# Altium project IOT_GRN_MAIN V1.0 A.PrjPcb
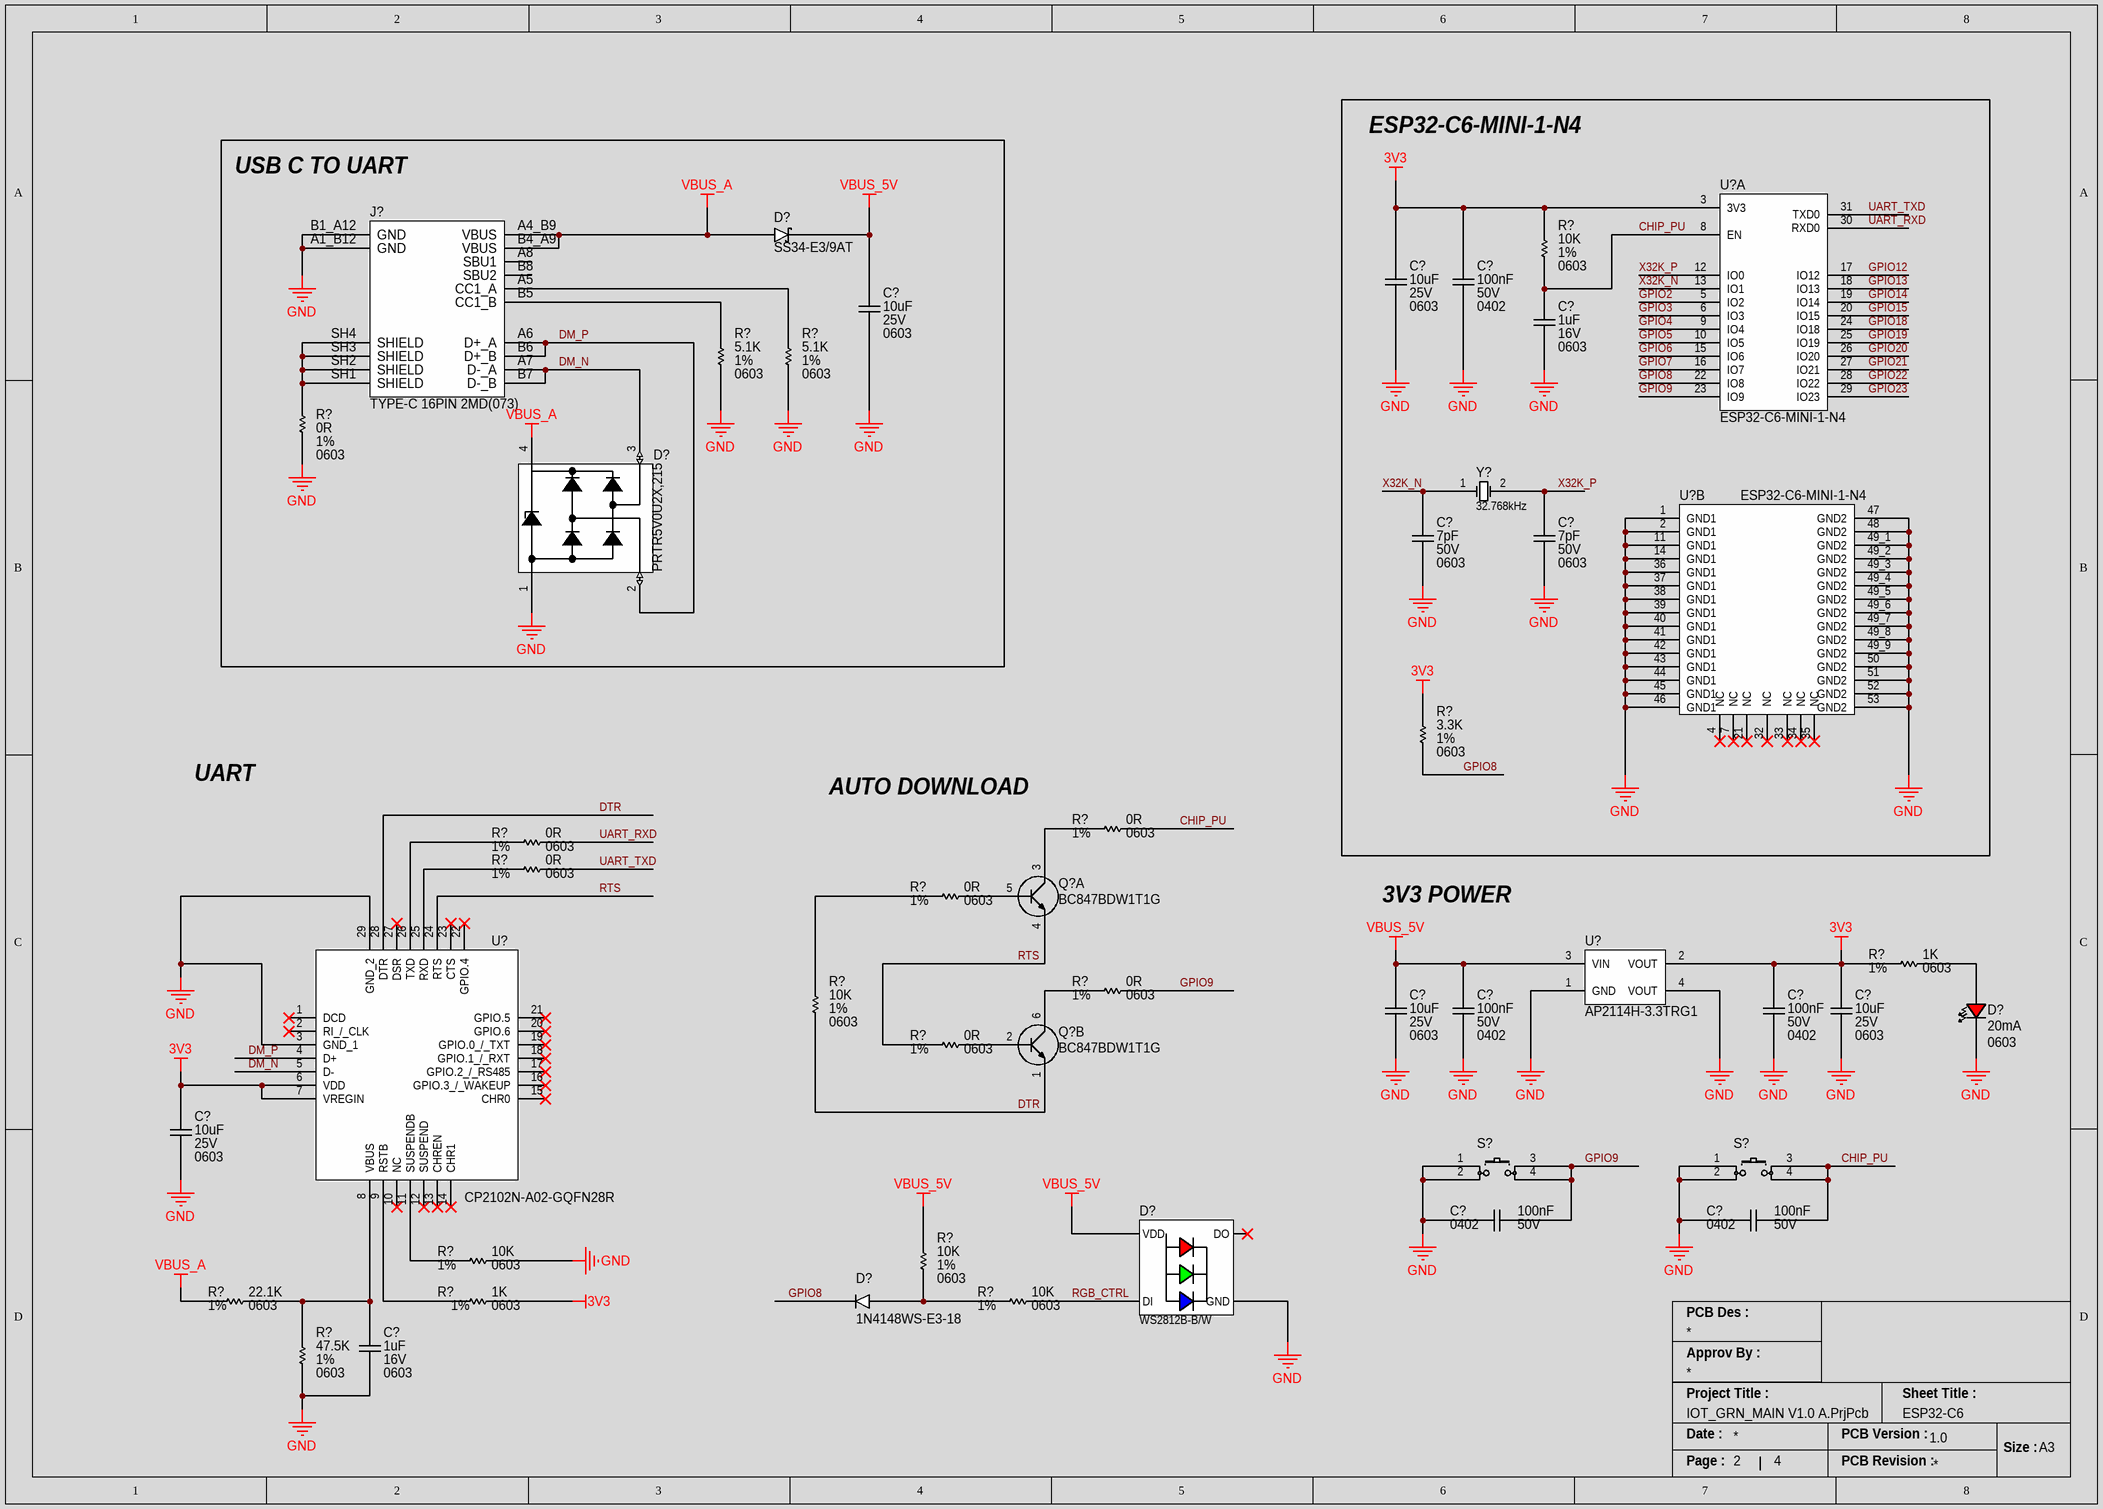
[diagram p0: IOT_GRN_MAIN V1.0 A - ESP32.SchDoc]
Letter: A; ProjectTitle: IOT_GRN_MAIN V1.0 A; Version: 1.0
2 sheets, 48 parts. Net scope: global (net labels, ports and power ports of the same name join across sheets).
Board file: IOT_GRN_MAIN V1.0 A.PcbDoc
Sheets:
  IOT_GRN_MAIN V1.0 A - ESP32.SchDoc
  IOT_GRN_MAIN V1.0 A - CONNECTORS.SchDoc

## Sheet IOT_GRN_MAIN V1.0 A - ESP32.SchDoc
size A3; SheetNumber: 2; SheetTotal: 4; Sheet Title: ESP32-C6

### Parts
(Parts that share a designator on the sheet are numbered #1, #2 ... from top to bottom, then left to right.)
C?#1  Case/Package: 0603  Capacitance: 10uF  Voltage Rating: 25V  [CAP_0603_CAPC1608X08N]  (hidden comment: GRM188R61E106MA73D)
C?#2  Voltage Rating: 50V  Capacitance: 100nF  Case/Package: 0402  [CAP_0402_CAPC1005X05N]  (hidden comment: GRM155R71H104KE14D)
C?#3  Case/Package: 0603  Capacitance: 10uF  Voltage Rating: 25V  [CAP_0603_CAPC1608X08N]  (hidden comment: GRM188R61E106MA73D)
C?#4  Voltage Rating: 16V  Capacitance: 1uF  Case/Package: 0603  [CAP_0603_CAPC1608X08N]  (hidden comment: CL10A105KO8NNNC)
C?#5  Voltage Rating (DC): 50V  Capacitance: 7pF  Case/Package: 0603  [CAP_0603_CAPC1608X08N]  (hidden comment: C1608C0G1H070D080AA)
C?#6  Voltage Rating (DC): 50V  Capacitance: 7pF  Case/Package: 0603  [CAP_0603_CAPC1608X08N]  (hidden comment: C1608C0G1H070D080AA)
C?#7  Case/Package: 0603  Capacitance: 10uF  Voltage Rating: 25V  [CAP_0603_CAPC1608X08N]  (hidden comment: GRM188R61E106MA73D)
C?#8  Voltage Rating: 50V  Capacitance: 100nF  Case/Package: 0402  [CAP_0402_CAPC1005X05N]  (hidden comment: GRM155R71H104KE14D)
C?#9  Voltage Rating: 50V  Capacitance: 100nF  Case/Package: 0402  [CAP_0402_CAPC1005X05N]  (hidden comment: GRM155R71H104KE14D)
C?#10  Case/Package: 0603  Capacitance: 10uF  Voltage Rating: 25V  [CAP_0603_CAPC1608X08N]  (hidden comment: GRM188R61E106MA73D)
C?#11  Case/Package: 0603  Capacitance: 10uF  Voltage Rating: 25V  [CAP_0603_CAPC1608X08N]  (hidden comment: GRM188R61E106MA73D)
C?#12  Voltage Rating: 50V  Capacitance: 100nF  Case/Package: 0402  [CAP_0402_CAPC1005X05N]  (hidden comment: GRM155R71H104KE14D)
C?#13  Voltage Rating: 50V  Capacitance: 100nF  Case/Package: 0402  [CAP_0402_CAPC1005X05N]  (hidden comment: GRM155R71H104KE14D)
C?#14  Voltage Rating: 16V  Capacitance: 1uF  Case/Package: 0603  [CAP_0603_CAPC1608X08N]  (hidden comment: CL10A105KO8NNNC)
D?#1  SS34-E3/9AT  [DIO_Vishay_SMC_MFG]
D?#2  PRTR5V0U2X,215  [DIO_TVS_Nexperia_SOT143B_MFG]
D?#3  Test Current: 20mA  Case/Package: 0603  [LED_0603-RED-0.75mm]  (hidden comment: LTST-C190KRKT)
D?#4  1N4148WS-E3-18  [DIO_SOD2713X115N]
D?#5  WS2812B-B/W  [LED_RGB_WS2812B_SNAPEDA]
J?  TYPE-C 16PIN 2MD(073)  [CONN_USB_C_16P]
Q?#1  BC847BDW1T1G  [TRANS_BJT_SOT65P210X110-6N]  (part A of 2)
Q?#2  BC847BDW1T1G  [TRANS_BJT_SOT65P210X110-6N]  (part B of 2)
R?#1  Resistance: 10K  Tolerance: 1%  Case/Package: 0603  [RES_0603_RESC1608X04N]  (hidden comment: AC0603FR-1010KL)
R?#2  Tolerance: 1%  Resistance: 5.1K  Case/Package: 0603  [RES_0603_RESC1608X04N]  (hidden comment: RC0603FR-075K1L)
R?#3  Tolerance: 1%  Resistance: 5.1K  Case/Package: 0603  [RES_0603_RESC1608X04N]  (hidden comment: RC0603FR-075K1L)
R?#4  Tolerance: 1%  Resistance: 0R  Case Code (Imperial): 0603  [RES_0603_RESC1608X04N]  (hidden comment: RC0603FR-070RL)
R?#5  Tolerance: 1%  Resistance: 3.3K  Case/Package: 0603  [RES_0603_RESC1608X04N]  (hidden comment: RC0603FR-073K3L)
R?#6  Tolerance: 1%  Resistance: 0R  Case Code (Imperial): 0603  [RES_0603_RESC1608X04N]  (hidden comment: RC0603FR-070RL)
R?#7  Tolerance: 1%  Resistance: 0R  Case Code (Imperial): 0603  [RES_0603_RESC1608X04N]  (hidden comment: RC0603FR-070RL)
R?#8  Tolerance: 1%  Resistance: 0R  Case Code (Imperial): 0603  [RES_0603_RESC1608X04N]  (hidden comment: RC0603FR-070RL)
R?#9  Tolerance: 1%  Resistance: 0R  Case Code (Imperial): 0603  [RES_0603_RESC1608X04N]  (hidden comment: RC0603FR-070RL)
R?#10  Resistance: 1K  Tolerance: 1%  Case/Package: 0603  [RES_0603_RESC1608X04N]  (hidden comment: AC0603FR-101KL)
R?#11  Tolerance: 1%  Resistance: 0R  Case Code (Imperial): 0603  [RES_0603_RESC1608X04N]  (hidden comment: RC0603FR-070RL)
R?#12  Resistance: 10K  Tolerance: 1%  Case/Package: 0603  [RES_0603_RESC1608X04N]  (hidden comment: AC0603FR-1010KL)
R?#13  Tolerance: 1%  Resistance: 0R  Case Code (Imperial): 0603  [RES_0603_RESC1608X04N]  (hidden comment: RC0603FR-070RL)
R?#14  Resistance: 10K  Tolerance: 1%  Case/Package: 0603  [RES_0603_RESC1608X04N]  (hidden comment: AC0603FR-1010KL)
R?#15  Resistance: 10K  Tolerance: 1%  Case/Package: 0603  [RES_0603_RESC1608X04N]  (hidden comment: AC0603FR-1010KL)
R?#16  Resistance: 22.1K  Tolerance: 1%  Case/Package: 0603  [RES_0603_RESC1608X04N]  (hidden comment: RC0603FR-0722K1L)
R?#17  Resistance: 1K  Tolerance: 1%  Case/Package: 0603  [RES_0603_RESC1608X04N]  (hidden comment: AC0603FR-101KL)
R?#18  Resistance: 10K  Tolerance: 1%  Case/Package: 0603  [RES_0603_RESC1608X04N]  (hidden comment: AC0603FR-1010KL)
R?#19  Tolerance: 1%  Resistance: 47.5K  Case/Package: 0603  [RES_0603_RESC1608X04N]  (hidden comment: AC0603FR-0747K5L)
S?#1  PTS526SK15SMTR2LFS  [SWT_NO_PTS526SK15SMTR2LFS]  (value not drawn)
S?#2  PTS526SK15SMTR2LFS  [SWT_NO_PTS526SK15SMTR2LFS]  (value not drawn)
U?#1  ESP32-C6-MINI-1-N4  [IC_ESP32-C6-MINI-1-N4]  (part A of 2)
U?#2  ESP32-C6-MINI-1-N4  [IC_ESP32-C6-MINI-1-N4]  (part B of 2)
U?#3  AP2114H-3.3TRG1  [IC_REG_SOT230P700X180-4N]
U?#4  CP2102N-A02-GQFN28R  [IC_BRIDGE_UART_QFN50P500X500X80-29N-D]
Y?  Frequency: 32.768kHz  [CRYSTAL_FC135327680KAAG5]  (hidden comment: FC-135 32.7680KA-AG5)

### Blocks framed on the sheet
ESP32-C6-MINI-1-N4: C?#1 C?#2 C?#4-C?#6 R?#1 R?#5 U?#1 U?#2 Y?
USB C TO UART: C?#3 D?#1 D?#2 J? R?#2-R?#4

### Nets
3V3: C?#1.2 C?#2.2 C?#9.2 C?#10.2 C?#11.2 R?#1.2 R?#5.2 R?#10.1 R?#17.2 U?#1.3(3V3) U?#3.2(VOUT) U?#4.6(VDD) U?#4.7(VREGIN)
GND: C?#1.1 C?#2.1 C?#3.1 C?#4.1 C?#5.2 C?#6.1 C?#7.1 C?#8.1 C?#9.1 C?#10.1 C?#11.1 C?#12.2 C?#13.2 C?#14.1 D?#2.1(GND) D?#3.1(C) D?#5.3(GND) J?.A1_B12(GND) J?.B1_A12(GND) R?#2.1 R?#3.1 R?#4.1 R?#15.2 R?#19.1 S?#1.1(COM_1) S?#1.2(COM2) S?#2.1(COM_1) S?#2.2(COM2) U?#2.1(GND1) U?#2.2(GND1) U?#2.11(GND1) U?#2.14(GND1) U?#2.36(GND1) U?#2.37(GND1) U?#2.38(GND1) U?#2.39(GND1) U?#2.40(GND1) U?#2.41(GND1) U?#2.42(GND1) U?#2.43(GND1) U?#2.44(GND1) U?#2.45(GND1) U?#2.46(GND1) U?#2.47(GND2) U?#2.48(GND2) U?#2.49_1(GND2) U?#2.49_2(GND2) U?#2.49_3(GND2) U?#2.49_4(GND2) U?#2.49_5(GND2) U?#2.49_6(GND2) U?#2.49_7(GND2) U?#2.49_8(GND2) U?#2.49_9(GND2) U?#2.50(GND2) U?#2.51(GND2) U?#2.52(GND2) U?#2.53(GND2) U?#3.1(GND) U?#3.4(VOUT) U?#4.3(GND_1) U?#4.29(GND_2)
VBUS_5V: C?#3.2 C?#7.2 C?#8.2 D?#1.1(K) D?#5.1(VDD) R?#14.1 U?#3.3(VIN)
VBUS_A: D?#1.2(A) D?#2.4(VCC) J?.A4_B9(VBUS) J?.B4_A9(VBUS) R?#16.1
CHIP_PU: C?#4.2 C?#13.1 R?#1.1 R?#6.1 S?#2.3(NO1) S?#2.4(NO2) U?#1.8(EN)
DM_N: D?#2.3(I/O_2) J?.A7(D-_A) J?.B7(D-_B) U?#4.5(D-)
DM_P: D?#2.2(I/O_1) J?.A6(D+_A) J?.B6(D+_B) U?#4.4(D+)
DTR: Q?#2.1(EMITTER_2) R?#12.1 U?#4.28(DTR)
GPIO2: U?#1.5(IO2)
GPIO3: U?#1.6(IO3)
GPIO4: U?#1.9(IO4)
GPIO5: U?#1.10(IO5)
GPIO6: U?#1.15(IO6)
GPIO7: U?#1.16(IO7)
GPIO8: D?#4.1(K) R?#5.1 U?#1.22(IO8)
GPIO9: C?#12.1 R?#11.1 S?#1.3(NO1) S?#1.4(NO2) U?#1.23(IO9)
GPIO12: U?#1.17(IO12)
GPIO13: U?#1.18(IO13)
GPIO14: U?#1.19(IO14)
GPIO15: U?#1.20(IO15)
GPIO18: U?#1.24(IO18)
GPIO19: U?#1.25(IO19)
GPIO20: U?#1.26(IO20)
GPIO21: U?#1.27(IO21)
GPIO22: U?#1.28(IO22)
GPIO23: U?#1.29(IO23)
RGB_CTRL: D?#5.4(DI) R?#18.1
RTS: Q?#1.4(EMITTER_1) R?#13.2 U?#4.24(RTS)
UART_RXD: R?#7.1 U?#1.30(RXD0)
UART_TXD: R?#8.1 U?#1.31(TXD0)
X32K_N: C?#6.2 U?#1.13(IO1) Y?.1(OSC1)
X32K_P: C?#5.1 U?#1.12(IO0) Y?.2(OSC2)
NetC?#14_2: C?#14.2 R?#16.2 R?#19.2 U?#4.8(VBUS)
NetD?#3_2: D?#3.2(A) R?#10.2
NetD?#4_2: D?#4.2(A) R?#14.2 R?#18.2
NetJ?_A5: J?.A5(CC1_A) R?#3.2
NetJ?_B5: J?.B5(CC1_B) R?#2.2
NetJ?_SH1: J?.SH1(SHIELD) J?.SH2(SHIELD) J?.SH3(SHIELD) J?.SH4(SHIELD) R?#4.2
NetQ?#1_3: Q?#1.3(COLLECTOR_1) R?#6.2
NetQ?#1_5: Q?#1.5(BASE_1) R?#9.1
NetQ?#2_2: Q?#2.2(BASE_2) R?#13.1
NetQ?#2_6: Q?#2.6(COLLECTOR_2) R?#11.2
NetR?#7_2: R?#7.2 U?#4.26(TXD)
NetR?#8_2: R?#8.2 U?#4.25(RXD)
NetR?#9_2: R?#9.2 R?#12.2
NetR?#15_1: R?#15.1 U?#4.11(SUSPENDB)
NetR?#17_1: R?#17.1 U?#4.9(RSTB)

Not connected (* = marked no-connect by the designer): D?#5 2(DO)*; J? A8(SBU1) B8(SBU2); U?#2 4(NC)* 7(NC)* 21(NC)* 32(NC)* 33(NC)* 34(NC)* 35(NC)*; U?#4 1(DCD)* 2(RI_/_CLK)* 10(NC)* 12(SUSPEND)* 13(CHREN)* 14(CHR1)* 15(CHR0)* 16(GPIO.3_/_WAKEUP)* 17(GPIO.2_/_RS485)* 18(GPIO.1_/_RXT)* 19(GPIO.0_/_TXT)* 20(GPIO.6)* 21(GPIO.5)* 22(GPIO.4)* 23(CTS)* 27(DSR)*

### Notes on the sheet
- UART
- AUTO DOWNLOAD
- 3V3 POWER
- PCB Des :
- Approv By :
- Project Title :
- Sheet Title :
- Date :
- PCB Version :
- Size :
- A3
- Page :
- PCB Revision :

### Library data of the parts
C?#1 C?#3 C?#7 C?#10 C?#11 = CAP_10UF_25V_X5R_0603: Multilayer Ceramic Capacitor, 10 uF, 25 V, ± 20%, X5R, 0603 [1608 Metric]; Manufacturer: Murata; Material: 4241ConductorMaterial; Supplier 1: Digi-Key; Manufacturer Part Number: GRM188R61E106MA73D; RoHS: Yes; Category: Ceramic Capacitors; Stock 1: 2712970; Pricing 1: 1=0.26, 10=0.168, 50=0.1176, 100=0.0949, 500=0.07054, 1000=0.06173 (USD); Mount: Surface Mount; Number of Pins: 2; Case Code (Imperial): 0603; Weight: 0.000222oz; Min Operating Temperature: -55°C; Max Operating Temperature: 85°C; Tolerance: 20%; Packaging: Cut Tape; Package Quantity: 1; Dielectric: X5R; Voltage: 25V; Termination: SMD/SMT; Voltage Rating (DC): 25V; Series: GRM; Construction: Flat; Length: 1.6mm; Width: 0.031inch; Height: 0.8mm; Thickness: 0.031inch; Depth: 0.8mm; Reach SVHC Compliant: No; Lead Free: Lead Free; RoHS Compliant: Yes; ComponentLink1URL: https://datasheet.ciiva.com/22776/c02e-22776427.pdf?src-supplier=Farnell; ComponentLink1Description: https://datasheet.ciiva.com/22776/c02e-22776427.pdf?src-supplier=Farnell; ComponentLink2URL: https://datasheet.ciiva.com/22619/c02e-22619674.pdf?src-supplier=Element14; ComponentLink2Description: https://datasheet.ciiva.com/22619/c02e-22619674.pdf?src-supplier=Element14; ComponentLink3URL: https://datasheet.ciiva.com/22776/608985-22776426.pdf?src-supplier=Farnell; ComponentLink3Description: https://datasheet.ciiva.com/22776/608985-22776426.pdf?src-supplier=Farnell; ComponentLink4URL: https://datasheet.ciiva.com/14906/partnumbering-e-01-14906431.pdf?src-supplier=Digi-Key; ComponentLink4Description: https://datasheet.ciiva.com/14906/partnumbering-e-01-14906431.pdf?src-supplier=Digi-Key; ComponentLink5URL: https://datasheet.ciiva.com/14906/partnumbering-e-01-14906429.pdf?src-supplier=Digi-Key; ComponentLink5Description: https://datasheet.ciiva.com/14906/partnumbering-e-01-14906429.pdf?src-supplier=Digi-Key; Supplier Part Number 1: 490-7202-1-ND; Case Code (Metric): 1608
C?#2 C?#8 C?#9 C?#12 C?#13 = CAP_100NF_50V_X7R_0402: Multilayer Ceramic Capacitor, 0.1 uF, 16 V, ± 10%, X7R, 0402 [1005 Metric]; Manufacturer: Murata; Dissipation Factor: 0.025%; Temperature Coefficient: 30ppm/°C; Supplier 1: DigiKey; Manufacturer Part Number: GRM155R71H104KE14D; RoHS: Yes; Category: Ceramic Capacitors; Stock 1: 13730790; Pricing 1: 1=0.1, 10=0.023, 50=0.0132, 100=0.0102, 500=0.00768, 1000=0.00603, 2500=0.00548, 5000=0.00504 (USD); Mount: Surface Mount; Number of Pins: 2NUMBER; Case Code (Metric): 1005; Material: Ceramic; Case Code (Imperial): 0402; Weight: 0.000212oz; Dielectric Material: Ceramic; Min Operating Temperature: -55°C; Max Operating Temperature: 125°C; Packaging: Tape and Reel; Package Quantity: 10000; Series: GRM; Tolerance: 10%; Dielectric: X7R; Termination: SMD/SMT; Voltage: 50V; Voltage Rating (DC): 50V; Construction: Flat; Length: 1mm; Width: 0.5mm; Height: 0.5mm; Depth: 0.5mm; Thickness: 0.022inch; Reach SVHC Compliant: No; RoHS Compliant: Yes; Lead Free: 5697LeadFree; ComponentLink1URL: http://www.farnell.com/datasheets/2079156.pdf?src-supplier=Farnell; ComponentLink1Description: http://www.farnell.com/datasheets/2079156.pdf?src-supplier=Farnell; ComponentLink2URL: http://www.mouser.com/ds/2/281/c02e-2905.pdf?src-supplier=Mouser; ComponentLink2Description: http://www.mouser.com/ds/2/281/c02e-2905.pdf?src-supplier=Mouser; ComponentLink3URL: http://www.farnell.com/datasheets/2079156.pdf?src-supplier=Newark; ComponentLink3Description: http://www.farnell.com/datasheets/2079156.pdf?src-supplier=Newark; ComponentLink4URL: https://datasheet.octopart.com/GRM155R71H104KE14D-Murata-datasheet-22122223.pdf?src-supplier=Future+Electronics; ComponentLink4Description: https://datasheet.octopart.com/GRM155R71H104KE14D-Murata-datasheet-22122223.pdf?src-supplier=Future+Electronics; ComponentLink5URL: https://search.murata.co.jp/Ceramy/image/img/A01X/G101/ENG/GRM155R71H104KE14-01.pdf?src-supplier=Digi-Key; ComponentLink5Description: https://search.murata.co.jp/Ceramy/image/img/A01X/G101/ENG/GRM155R71H104KE14-01.pdf?src-supplier=Digi-Key; ComponentLink6URL: http://psearch.en.murata.com/capacitor/product/GRM155R71H104KE14%23.pdf?src-supplier=Avnet; ComponentLink6Description: http://psearch.en.murata.com/capacitor/product/GRM155R71H104KE14%23.pdf?src-supplier=Avnet; ComponentLink7URL: https://datasheet.octopart.com/GRM155R71H104KE14D-Murata-datasheet-66077078.pdf?src-supplier=Element14; ComponentLink7Description: https://datasheet.octopart.com/GRM155R71H104KE14D-Murata-datasheet-66077078.pdf?src-supplier=Element14; Supplier Part Number 1: 490-10700-6-ND; Supplier 2: Digikey; Stock 2: 3706055; Pricing 2: 1=0.1, 10=0.037, 50=0.021, 100=0.0162, 500=0.01224, 1000=0.00961, 2500=0.00874, 5000=0.00804 (USD); Halogen Free: 5694HalogenFree; ComponentLink8URL: http://www.mouser.com/ds/2/447/UPY-GPHC_X5R_4V-to-50V_25-1131599.pdf?src-supplier=Mouser; ComponentLink8Description: http://www.mouser.com/ds/2/447/UPY-GPHC_X5R_4V-to-50V_25-1131599.pdf?src-supplier=Mouser; ComponentLink9URL: https://datasheet.octopart.com/CC0402KRX5R8BB104-Yageo-datasheet-137700082.pdf?src-supplier=Future+Electronics; ComponentLink9Description: https://datasheet.octopart.com/CC0402KRX5R8BB104-Yageo-datasheet-137700082.pdf?src-supplier=Future+Electronics; ComponentLink10URL: http://www.yageo.com/documents/recent/UPY-GPHC_X5R_4V-to-50V_25.pdf?src-supplier=Digikey; ComponentLink10Description: http://www.yageo.com/documents/recent/UPY-GPHC_X5R_4V-to-50V_25.pdf?src-supplier=Digikey; ComponentLink11URL: https://datasheet.octopart.com/CC0402KRX5R8BB104-Yageo-datasheet-140260304.pdf?src-supplier=Newark; ComponentLink11Description: https://datasheet.octopart.com/CC0402KRX5R8BB104-Yageo-datasheet-140260304.pdf?src-supplier=Newark; ComponentLink12URL: https://datasheet.octopart.com/CC0402KRX5R8BB104-Yageo-datasheet-170350636.pdf?src-supplier=Future+Electronics; ComponentLink12Description: https://datasheet.octopart.com/CC0402KRX5R8BB104-Yageo-datasheet-170350636.pdf?src-supplier=Future+Electronics; ComponentLink13URL: http://www.yageo.com/documents/recent/UPY-GPHC_X5R_4V-to-50V-16.pdf?src-supplier=Future+Electronics; ComponentLink13Description: http://www.yageo.com/documents/recent/UPY-GPHC_X5R_4V-to-50V-16.pdf?src-supplier=Future+Electronics; Supplier Part Number 2: 311-1697-1-ND
C?#4 C?#14 = CAP_1UF_16V_X5R_0603: CAP CER 1UF 16V X5R 0603; Manufacturer: Samsung; Material: Ceramic; Tolerance: 10%; Manufacturer Part Number: CL10A105KO8NNNC; RoHS: Yes; Category: Ceramic Capacitors; Stock 1: 252255; Pricing 1: 1=0.10000, 10=0.03300, 50=0.01800, 100=0.01470, 500=0.01050, 1000=0.00825 (USD); Mount: Surface Mount; Case Code (Metric): 1608; Case Code (Imperial): 0603; Contact Plating: Tin; Min Operating Temperature: -55°C; Max Operating Temperature: 85°C; Package Quantity: 1; Packaging: Tape and Reel; Dielectric: X5R; Voltage Rating (DC): 16V; Series: CL; Voltage: 16V; Construction: Flat; Length: 1.6mm; Width: 0.031inch; Height: 0.8mm; Thickness: 0.035inch; Depth: 0.8mm; Radiation Hardening: No; Lead Free: Lead Free; RoHS Compliant: Yes; ComponentLink1URL: https://datasheet.ciiva.com/16199/cl10a105ko8nnnc-16199033.pdf?src-supplier=Future+Electronics; ComponentLink1Description: https://datasheet.ciiva.com/16199/cl10a105ko8nnnc-16199033.pdf?src-supplier=Future+Electronics; ComponentLink2URL: https://datasheet.ciiva.com/15195/getdatasheetpartid-359688-15195706.pdf?src-supplier=Verical; ComponentLink2Description: https://datasheet.ciiva.com/15195/getdatasheetpartid-359688-15195706.pdf?src-supplier=Verical; ComponentLink3URL: https://datasheet.ciiva.com/29198/458190-da-01-en-vs-kondensator-0603-29198480.pdf?src-supplier=Conrad; ComponentLink3Description: https://datasheet.ciiva.com/29198/458190-da-01-en-vs-kondensator-0603-29198480.pdf?src-supplier=Conrad; Supplier 1: Digi-Key; Supplier 2: Mouser; Supplier 3: Newark; Supplier Part Number 1: 1276-1034-1-ND; Supplier Part Number 2: 187-CL10A105KO8NNNC; Supplier Part Number 3: 82AC9279
C?#5 C?#6 = CAP_7PF_50V_NP0_0603: C Series 0603 7 pF 50 V ±0.5 pF Tolerance C0G SMT Multilayer Ceramic Capacitor; Manufacturer: TDK; Supplier 1: Digi-Key; Manufacturer Part Number: C1608C0G1H070D080AA; RoHS: Yes; Category: Ceramic Capacitors; Stock 1: 64389; Pricing 1: 1=0.1, 10=0.073, 50=0.0414, 100=0.0343, 500=0.02402, 1000=0.01989 (USD); Mount: Surface Mount; Dielectric Material: Ceramic; Case Code (Metric): 1608; Case Code (Imperial): 0603; Weight: 7.1E-05oz; Min Operating Temperature: -55°C; Max Operating Temperature: 125°C; Construction: Flat; Packaging: Tape and Reel; Voltage Rating: 50V; Package Quantity: 4000; Dielectric: C0G; Termination: SMD/SMT; Series: C; Length: 1.6mm; Width: 0.8mm; Height: 0.8mm; Depth: 0.8mm; Lead Free: Lead Free; RoHS Compliant: Yes; Reach SVHC Compliant: No; ComponentLink1URL: https://datasheet.ciiva.com/24217/c1608c0g1h070d080aa-264569-24217366.pdf?src-supplier=Mouser; ComponentLink1Description: https://datasheet.ciiva.com/24217/c1608c0g1h070d080aa-264569-24217366.pdf?src-supplier=Mouser; ComponentLink2URL: https://datasheet.ciiva.com/16427/e413-c-16427733.pdf?src-supplier=Future+Electronics; ComponentLink2Description: https://datasheet.ciiva.com/16427/e413-c-16427733.pdf?src-supplier=Future+Electronics; ComponentLink3URL: https://datasheet.ciiva.com/6293/tdkmlcccaprange-6293212.pdf?src-supplier=Digi-Key; ComponentLink3Description: https://datasheet.ciiva.com/6293/tdkmlcccaprange-6293212.pdf?src-supplier=Digi-Key; ComponentLink4URL: https://datasheet.ciiva.com/6293/tdkmlcccaprange-6293215.pdf?src-supplier=Digi-Key; ComponentLink4Description: https://datasheet.ciiva.com/6293/tdkmlcccaprange-6293215.pdf?src-supplier=Digi-Key; Supplier Part Number 1: 445-5041-1-ND
D?#1 = DIO_SCTKY_40V_3A: Rectifier Diode, schottky, 40V V(Rrm), do-214Ab / Smc; Manufacturer: Vishay Semiconductors; Max Surge Current: 100A; Element Configuration: Single; Max Reverse Leakage Current: 500uA; Average Rectified Current: 3A; Forward Voltage: 500mV; Supplier 1: TTI; Manufacturer Part Number: SS34-E3/9AT; RoHS: Yes; Category: Rectifier Diodes; Stock 1: 7000; Pricing 1: 3500=0.18200 (USD); Mount: Surface Mount; Case/Package: SMC; Number of Pins: 2; Min Operating Temperature: -55°C; Max Operating Temperature: 125°C; Package Quantity: 3500; Packaging: Tape and Reel; Peak Non-Repetitive Surge Current: 100A; Max Reverse Voltage (DC): 40V; Series: -; Radiation Hardening: No; RoHS Compliant: Yes; ComponentLink1URL: https://datasheet.ciiva.com/920/ss32-920172.pdf?src-supplier=Digi-Key; ComponentLink1Description: https://datasheet.ciiva.com/920/ss32-920172.pdf?src-supplier=Digi-Key; Supplier Part Number 1: SS34-E3/9AT; Max Reverse Current: 500uA; Max Repetitive Reverse Voltage (Vrrm): 40V; Forward Current: 3A
D?#2 = DIO_TVS_USB_PRTR5V0U2X,215: PRTR5V0U2X - Ultra low capacitance double rail-to-rail ESD protection diode; Manufacturer: Nexperia; Supplier 1: Mouser; Manufacturer Part Number: PRTR5V0U2X,215; RoHS: Yes; Category: ESD and Circuit Protection ICs; Stock 1: 109301; Pricing 1: 1=0.45, 10=0.368, 50=0.367, 100=0.262, 500=0.21, 1000=0.171, 3000=0.135, 9000=0.129, 10000=0.129, 24000=0.127, 45000=0.125 (USD); RoHS Compliant: Yes; ComponentLink1URL: http://www.farnell.com/datasheets/109718.pdf?src-supplier=Farnell; ComponentLink1Description: http://www.farnell.com/datasheets/109718.pdf?src-supplier=Farnell; ComponentLink2URL: https://assets.nexperia.com/documents/data-sheet/PRTR5V0U2X.pdf?src-supplier=Digikey; ComponentLink2Description: https://assets.nexperia.com/documents/data-sheet/PRTR5V0U2X.pdf?src-supplier=Digikey; ComponentLink3URL: http://www.farnell.com/datasheets/109718.pdf?src-supplier=Newark; ComponentLink3Description: http://www.farnell.com/datasheets/109718.pdf?src-supplier=Newark; ComponentLink4URL: https://datasheet.octopart.com/PRTR5V0U2X%2C215-Nexperia-datasheet-5405949.pdf?src-supplier=Element14; ComponentLink4Description: https://datasheet.octopart.com/PRTR5V0U2X%2C215-Nexperia-datasheet-5405949.pdf?src-supplier=Element14; Supplier Part Number 1: 771-PRTR5V0U2X-T/R
D?#3 = LED_DIO_RED_20mA_0603: LED,  LTST-C190KRKT; Manufacturer: Vishay Lite-On; Color: Red; Lens Color: Colorless; Luminous Intensity: 54mcd; Viewing Angle: 130°; Lens Style: Diffused,Colorless,Clear,Rectangular; Power Rating: 75mW; Dominant Wavelength: 631nm; Lens Transparency: Clear; Number of Elements: 1; Wavelength: 639nm; Reverse Voltage: 5V; Forward Current: 30mA; Forward Voltage: 2.4V; Manufacturer Part Number: LTST-C190KRKT; RoHS: Yes; Category: LEDs; Stock 1: 712361; Pricing 1: 1=0.24000, 10=0.13200, 100=0.06110, 500=0.05640, 1000=0.04418, 2000=0.04324 (USD); Mount: Surface Mount; Number of Pins: 2; Case Code (Metric): 1608; Case Code (Imperial): 0603; Min Operating Temperature: -55°C; Max Operating Temperature: 85°C; Packaging: Tape and Reel; Package Quantity: 1; Illumination Color: Red; Power Dissipation: 75mW; Number of LEDs: 1; Length: 1.6mm; Width: 0.8mm; Height: 0.8mm; Depth: 0.8mm; Radiation Hardening: No; Lead Free: Lead Free; RoHS Compliant: Yes; ComponentLink1URL: https://datasheet.ciiva.com/19482/1260381-19482354.pdf?src-supplier=Jameco; ComponentLink1Description: https://datasheet.ciiva.com/19482/1260381-19482354.pdf?src-supplier=Jameco; ComponentLink2URL: https://datasheet.ciiva.com/12403/100-ltst-c190krkt-59805-12403895.pdf?src-supplier=Mouser; ComponentLink2Description: https://datasheet.ciiva.com/12403/100-ltst-c190krkt-59805-12403895.pdf?src-supplier=Mouser; ComponentLink3URL: https://datasheet.ciiva.com/16427/ltst-c190krkt-16427674.pdf?src-supplier=Future+Electronics; ComponentLink3Description: https://datasheet.ciiva.com/16427/ltst-c190krkt-16427674.pdf?src-supplier=Future+Electronics; ComponentLink4URL: https://datasheet.ciiva.com/15117/getdatasheetpartid-57395-15117240.pdf?src-supplier=Verical; ComponentLink4Description: https://datasheet.ciiva.com/15117/getdatasheetpartid-57395-15117240.pdf?src-supplier=Verical; ComponentLink5URL: https://datasheet.ciiva.com/11774/0900766b80dc02a9-11774043.pdf?src-supplier=Rs; ComponentLink5Description: https://datasheet.ciiva.com/11774/0900766b80dc02a9-11774043.pdf?src-supplier=Rs; ComponentLink6URL: https://datasheet.ciiva.com/2109/s-110-ltst-c190krkt-2109992.pdf?src-supplier=Digi-Key; ComponentLink6Description: https://datasheet.ciiva.com/2109/s-110-ltst-c190krkt-2109992.pdf?src-supplier=Digi-Key; ComponentLink7URL: https://datasheet.ciiva.com/2109/s-110-ltst-c190krkt-2109991.pdf?src-supplier=Digi-Key; ComponentLink7Description: https://datasheet.ciiva.com/2109/s-110-ltst-c190krkt-2109991.pdf?src-supplier=Digi-Key; ComponentLink8URL: https://datasheet.ciiva.com/2109/s-110-ltst-c190krkt-2109993.pdf?src-supplier=Digi-Key; ComponentLink8Description: https://datasheet.ciiva.com/2109/s-110-ltst-c190krkt-2109993.pdf?src-supplier=Digi-Key; ComponentLink9URL: https://datasheet.ciiva.com/26937/getdatasheetpartid-631582-26937958.pdf?src-supplier=Verical; ComponentLink9Description: https://datasheet.ciiva.com/26937/getdatasheetpartid-631582-26937958.pdf?src-supplier=Verical; Supplier 1: Digi-Key; Supplier 2: Mouser; Supplier 3: Arrow Electronics; Supplier Part Number 1: 160-1436-6-ND; Supplier Part Number 2: 859-LTST-C190KRKT; Supplier Part Number 3: LTST-C190KRKT
D?#4 = DIO_RECT_100V_150mA_1N4148WS-E3-18: Rectifier Diode Small Signal Switching Si 100V 0.15A 4ns 2-Pin SOD-323 T/R; Manufacturer: Vishay Semiconductors; Max Surge Current: 350mA; Forward Voltage: 1.2V; Forward Current: 150mA; Max Power Dissipation: 200mW; Max Reverse Leakage Current: 100uA; Max Reverse Voltage (DC): 75V; Supplier 1: Digi-Key; Manufacturer Part Number: 1N4148WS-E3-18; RoHS: Yes; Category: Rectifier Diodes; Stock 1: 23792; Pricing 1: 1=0.23, 10=0.155, 100=0.0755, 500=0.06302, 1000=0.04378, 2000=0.03795, 5000=0.0352 (USD); Mount: Surface Mount; Number of Pins: 2; Weight: 0.000152oz; Contact Plating: Tin; Min Operating Temperature: -55°C; Max Operating Temperature: 150°C; Packaging: Tape and Reel; Recovery Time: 4ns; Package Quantity: 10000; Average Rectified Current: 150mA; Reverse Recovery Time: 4ns; Peak Non-Repetitive Surge Current: 350mA; Max Repetitive Reverse Voltage (Vrrm): 100V; Max Forward Surge Current (Ifsm): 350mA; Series: -; Radiation Hardening: No; RoHS Compliant: Yes; Reach SVHC Compliant: Unknown; ComponentLink1URL: https://datasheet.ciiva.com/29885/1n4148ws-29885947.pdf?src-supplier=Avnet; ComponentLink1Description: https://datasheet.ciiva.com/29885/1n4148ws-29885947.pdf?src-supplier=Avnet; Supplier Part Number 1: 1N4148WS-E3-18GICT-ND
D?#5 = LED_DIO_RGB_WS2812B-B/W: RGB SMD5050 Light Emitting Diodes (LED) ROHS - LCSC; Manufacturer: Worldsemi; Manufacturer Part Number: 5050; Color: Blue,Green,Red; Number of LEDs: 10; Supplier 1: LCSC; RoHS: Yes; Category: LEDs; Stock 1: 1874; Mount: Surface Mount; Length: 5mm; Width: 5mm; Supplier Part Number 1: 1528-1104-ND; ComponentLink1Description: https://www.lcsc.com/product-detail/Light-Emitting-Diodes-LED_Worldsemi-WS2812B-B-W_C114586.html; ComponentLink1URL: https://www.lcsc.com/product-detail/Light-Emitting-Diodes-LED_Worldsemi-WS2812B-B-W_C114586.html; Pricing 1: 1=0.09(USD)
J? = CONN_USB_TYPEC_2.0_16P_TYPE-C 16PIN 2MD(073): 5A 1 Surface Mount 16P Female -25℃~+85℃ Type-C SMD USB Connectors ROHS; Manufacturer: SHOU HAN; Supplier 1: LCSC; Manufacturer Part Number: TYPE-C 16PIN 2MD(073); RoHS: No; Category: Connectors; Pricing 1: 0.0523 (USD); Supplier Part Number 1: 664-12402012E212ACT-ND
Q?#1 Q?#2 = TRANS_BIPOLAR_NPN_BC847BDW1T1G: ON Semi BC847BDW1T1G Dual NPN Bipolar Transistor; 0.1 A; 45 V; 6-Pin SC-88; Manufacturer: ON Semiconductor; Max Power Dissipation: 380mW; Max Collector Current: 100mA; Collector Base Voltage (VCBO): 50V; Transition Frequency: 100MHz; Collector Emitter Breakdown Voltage: 45V; Collector-emitter Voltage-Max: 600mV; hFE Min: 200; Emitter Base Voltage (VEBO): 6V; Number of Elements: 2; Supplier 1: Digikey; Manufacturer Part Number: BC847BDW1T1G; RoHS: Yes; Category: BJTs; Stock 1: 35041; Pricing 1: 1=0.22, 10=0.149, 100=0.0729, 500=0.06078, 1000=0.04224 (USD); Case/Package: SOT-363-6; Number of Pins: 6; Contact Plating: Tin,Matte; Min Operating Temperature: -55°C; Max Operating Temperature: 150°C; Package Quantity: 3000; Packaging: Tape and Reel; Max Breakdown Voltage: 45V; Polarity: NPN; Series: -; Collector Emitter Voltage (VCEO): 45V; Collector Emitter Saturation Voltage: 600mV; Power Dissipation: 380mW; Max Frequency: 100MHz; Gain Bandwidth Product: 100MHz; Frequency: 100MHz; Voltage Rating (DC): 45V; Current Rating: 100mA; Length: 2mm; Width: 1.25mm; Height: 0.9mm; Radiation Hardening: No; RoHS Compliant: Yes; Lead Free: Lead Free; Halogen Free: Halogen Free; Reach SVHC Compliant: No; ComponentLink1URL: https://datasheet.ciiva.com/15138/getdatasheetpartid-32925-15138586.pdf?src-supplier=Verical; ComponentLink1Description: https://datasheet.ciiva.com/15138/getdatasheetpartid-32925-15138586.pdf?src-supplier=Verical; ComponentLink2URL: https://datasheet.ciiva.com/34303/2012187-34303831.pdf?src-supplier=Jameco; ComponentLink2Description: https://datasheet.ciiva.com/34303/2012187-34303831.pdf?src-supplier=Jameco; ComponentLink3URL: https://datasheet.ciiva.com/968/bc846bdw1t1-d-968805.pdf?src-supplier=Digikey; ComponentLink3Description: https://datasheet.ciiva.com/968/bc846bdw1t1-d-968805.pdf?src-supplier=Digikey; ComponentLink4URL: https://datasheet.ciiva.com/968/bc846bdw1t1-d-968806.pdf?src-supplier=Digikey; ComponentLink4Description: https://datasheet.ciiva.com/968/bc846bdw1t1-d-968806.pdf?src-supplier=Digikey; ComponentLink5URL: https://datasheet.ciiva.com/968/bc846bdw1t1-d-968807.pdf?src-supplier=Digikey; ComponentLink5Description: https://datasheet.ciiva.com/968/bc846bdw1t1-d-968807.pdf?src-supplier=Digikey; ComponentLink6URL: https://datasheet.ciiva.com/1215/bc846bdw1t1-d-1215105.pdf?src-supplier=Farnell; ComponentLink6Description: https://datasheet.ciiva.com/1215/bc846bdw1t1-d-1215105.pdf?src-supplier=Farnell; ComponentLink7URL: https://datasheet.ciiva.com/22653/1708249-22653900.pdf?src-supplier=Element14; ComponentLink7Description: https://datasheet.ciiva.com/22653/1708249-22653900.pdf?src-supplier=Element14; ComponentLink8URL: https://datasheet.ciiva.com/16201/bc846bdw1t1-d-16201675.pdf?src-supplier=Future+Electronics; ComponentLink8Description: https://datasheet.ciiva.com/16201/bc846bdw1t1-d-16201675.pdf?src-supplier=Future+Electronics; Supplier Part Number 1: BC847BDW1T1GOSCT-ND
R?#1 R?#12 R?#14 R?#15 R?#18 = RES_10K_1%_100mW_0603: Chip Resistor Automotive Grade Thick Film 0603 10kOhm 1% Paper T/R; Manufacturer: Yageo; Voltage Rating: 50V; Power Rating: 100mW; Temperature Coefficient: 100ppm/°C; Manufacturer Part Number: AC0603FR-1010KL; RoHS: Yes; Category: Chip SMD Resistors; Stock 1: 172891; Pricing 1: 1=0.10000, 10=0.02500, 100=0.01030, 1000=0.00463, 2500=0.00402, 5000=0.00332 (USD); Case Code (Imperial): 0603; Case Code (Metric): 1608; Weight: 7.1E-05oz; Min Operating Temperature: -55°C; Max Operating Temperature: 155°C; Packaging: Tape and Reel; Termination: SMD/SMT; Series: AC; Length: 1.6mm; Width: 0.8mm; Height: 0.45mm; RoHS Compliant: Yes; ComponentLink1URL: http://www.mouser.com/ds/2/447/yageodocoutput-1111992.pdf?src-supplier=Mouser; ComponentLink1Description: http://www.mouser.com/ds/2/447/yageodocoutput-1111992.pdf?src-supplier=Mouser; Supplier 1: Digi-Key; Supplier 2: Newark; Supplier 3: Avnet; Supplier Part Number 1: 13-AC0603FR-1010KLCT-ND; Supplier Part Number 2: 49AK0662; Supplier Part Number 3: 49AK0662
R?#2 R?#3 = RES_5.1K_1%_100mW_0603: SMD Chip Resistor, 5.1 kOhm, ± 1%, 100 mW, 0603 [1608 Metric], Thick Film, General Purpose; Manufacturer: Yageo; Power Rating: 100mW; Temperature Coefficient: 100ppm/°C; Voltage Rating (DC): 50V; Supplier 1: Digi-Key; Manufacturer Part Number: RC0603FR-075K1L; RoHS: Yes; Category: Chip SMD Resistors; Stock 1: 3197702; Pricing 1: 1=0.1, 10=0.018, 50=0.0106, 100=0.0088, 500=0.00592, 1000=0.00505 (USD); Number of Pins: 2; Case Code (Imperial): 0603; Case Code (Metric): 1608; Size Code: 0603; Min Operating Temperature: -55°C; Max Operating Temperature: 155°C; Series: RC; Packaging: Tape and Reel; Package Quantity: 1; Termination: SMD/SMT; Resistor Type: Thick Film; Number of Terminations: 2; Max Power Dissipation: 100mW; Features: Moisture Resistant; Resistance Tolerance: 1%; Construction: Rectangular; Length: 0.063inch; Width: 0.031inch; Height: 0.022inch; Depth: 0.8mm; RoHS Compliant: Yes; Reach SVHC Compliant: No; Military Standard: Not; Lead Free: Lead Free; ComponentLink1URL: https://datasheet.ciiva.com/15189/getdatasheetpartid-326732-15189786.pdf?src-supplier=Verical; ComponentLink1Description: https://datasheet.ciiva.com/15189/getdatasheetpartid-326732-15189786.pdf?src-supplier=Verical; ComponentLink2URL: https://datasheet.ciiva.com/46395/443971-46395016.pdf?src-supplier=Element14; ComponentLink2Description: https://datasheet.ciiva.com/46395/443971-46395016.pdf?src-supplier=Element14; ComponentLink3URL: https://datasheet.ciiva.com/2454/pyu-r-int-thick-7-2454045.pdf?src-supplier=Digi-Key; ComponentLink3Description: https://datasheet.ciiva.com/2454/pyu-r-int-thick-7-2454045.pdf?src-supplier=Digi-Key; ComponentLink4URL: https://datasheet.ciiva.com/2454/pyu-r-int-thick-7-2454046.pdf?src-supplier=Digi-Key; ComponentLink4Description: https://datasheet.ciiva.com/2454/pyu-r-int-thick-7-2454046.pdf?src-supplier=Digi-Key; ComponentLink5URL: https://datasheet.ciiva.com/2454/pyu-r-int-thick-7-2454047.pdf?src-supplier=Digi-Key; ComponentLink5Description: https://datasheet.ciiva.com/2454/pyu-r-int-thick-7-2454047.pdf?src-supplier=Digi-Key; Supplier Part Number 1: 311-5.10KHRCT-ND; Voltage Rating: 50V
R?#4 R?#6-R?#9 R?#11 R?#13 = RES_0R_1%_100mW_0603: RC Series 0603 0.1 W 0 Ohm Jumper Surface Mount Thick Film Chip Resistor; Manufacturer: Yageo; Power Rating: 100mW; Voltage Rating (DC): 50V; Temperature Coefficient: 200ppm/°C; Current Rating: 1A; Working Voltage: 75V; Supplier 1: Digi-Key; Manufacturer Part Number: RC0603FR-070RL; RoHS: Yes; Category: Chip SMD Resistors; Stock 1: 2843917; Pricing 1: 1=0.10000, 10=0.01800, 25=0.01320, 50=0.01000, 100=0.00730, 250=0.00560, 500=0.00448, 1000=0.00329 (USD); Case/Package: 0603; Number of Pins: 2; Contact Plating: Tin,Matte; Case Code (Metric): 1608; Min Operating Temperature: -55°C; Max Operating Temperature: 155°C; Packaging: Tape and Reel; Resistor Type: Thick Film; Package Quantity: 5000; Voltage Rating: 50V; Number of Terminations: 2; Termination: SMD/SMT; Max Power Dissipation: 100mW; Features: Moisture Resistant; Series: RC; Construction: Rectangular; Resistance Tolerance: 1%; Technology: THICK FILM; Length: 1.6mm; Width: 0.8mm; Height: 0.45mm; Depth: 0.8mm; Radiation Hardening: No; Reach SVHC Compliant: Yes; Lead Free: Lead Free; RoHS Compliant: Yes; Military Standard: Not; ComponentLink1URL: https://datasheet.ciiva.com/11808/0900766b80f96399-11808172.pdf?src-supplier=Rs; ComponentLink1Description: https://datasheet.ciiva.com/11808/0900766b80f96399-11808172.pdf?src-supplier=Rs; ComponentLink2URL: https://datasheet.ciiva.com/5684/443971-5684699.pdf?src-supplier=Farnell; ComponentLink2Description: https://datasheet.ciiva.com/5684/443971-5684699.pdf?src-supplier=Farnell; ComponentLink3URL: https://datasheet.ciiva.com/7983/443971-7983627.pdf?src-supplier=Element14; ComponentLink3Description: https://datasheet.ciiva.com/7983/443971-7983627.pdf?src-supplier=Element14; ComponentLink4URL: https://datasheet.ciiva.com/22643/1868787-22643388.pdf?src-supplier=Element14; ComponentLink4Description: https://datasheet.ciiva.com/22643/1868787-22643388.pdf?src-supplier=Element14; ComponentLink5URL: https://datasheet.ciiva.com/46382/443971-46382072.pdf?src-supplier=Element14; ComponentLink5Description: https://datasheet.ciiva.com/46382/443971-46382072.pdf?src-supplier=Element14; ComponentLink6URL: https://datasheet.ciiva.com/29721/pyu-r-int-thick-7-29721178.pdf?src-supplier=Digi-Key; ComponentLink6Description: https://datasheet.ciiva.com/29721/pyu-r-int-thick-7-29721178.pdf?src-supplier=Digi-Key; ComponentLink7URL: https://datasheet.ciiva.com/29721/pyu-rc0603-51-rohs-l-4-29721179.pdf?src-supplier=Digi-Key; ComponentLink7Description: https://datasheet.ciiva.com/29721/pyu-rc0603-51-rohs-l-4-29721179.pdf?src-supplier=Digi-Key; ComponentLink8URL: https://datasheet.ciiva.com/5558/rc0603-272842-5558341.pdf?src-supplier=Mouser; ComponentLink8Description: https://datasheet.ciiva.com/5558/rc0603-272842-5558341.pdf?src-supplier=Mouser; Supplier Part Number 1: 311-0.0HRCT-ND
R?#5 = RES_3.3K_1%_100mW_0603: SMD Chip Resistor, 3.3 kOhm, ± 1%, 100 mW, 0603 [1608 Metric], Thick Film, General Purpose; Manufacturer: Yageo; Voltage Rating (DC): 50V; Temperature Coefficient: 100ppm/°C; Power Rating: 100mW; Supplier 1: Digikey; Manufacturer Part Number: RC0603FR-073K3L; RoHS: Yes; Category: Chip SMD Resistors; Stock 1: 374027; Pricing 1: 1=0.1, 10=0.019, 50=0.0112, 100=0.0093, 500=0.00622, 1000=0.00532 (USD); Number of Pins: 2; Case Code (Imperial): 0603; Case Code (Metric): 1608; Size Code: 0603; Min Operating Temperature: -55°C; Max Operating Temperature: 155°C; Packaging: Tape and Reel; Resistor Type: Thick Film; Voltage Rating: 50V; Package Quantity: 1; Termination: SMD/SMT; Number of Terminations: 2; Max Power Dissipation: 100mW; Features: Moisture Resistant; Series: RC; Resistance Tolerance: 1%; Construction: Rectangular; Voltage Rating (AC): 50V; Length: 1.6mm; Width: 0.8mm; Height: 0.022inch; Depth: 0.8mm; Reach SVHC Compliant: No; Lead Free: Lead Free; Military Standard: Not; RoHS Compliant: Yes; ComponentLink1URL: https://datasheet.ciiva.com/2453/pyu-r-int-thick-7-2453926.pdf?src-supplier=Digikey; ComponentLink1Description: https://datasheet.ciiva.com/2453/pyu-r-int-thick-7-2453926.pdf?src-supplier=Digikey; ComponentLink2URL: https://datasheet.ciiva.com/2453/pyu-r-int-thick-7-2453927.pdf?src-supplier=Digikey; ComponentLink2Description: https://datasheet.ciiva.com/2453/pyu-r-int-thick-7-2453927.pdf?src-supplier=Digikey; ComponentLink3URL: https://datasheet.ciiva.com/7746/443971-7746344.pdf?src-supplier=Element14; ComponentLink3Description: https://datasheet.ciiva.com/7746/443971-7746344.pdf?src-supplier=Element14; ComponentLink4URL: https://datasheet.ciiva.com/7746/1686128-7746345.pdf?src-supplier=Element14; ComponentLink4Description: https://datasheet.ciiva.com/7746/1686128-7746345.pdf?src-supplier=Element14; ComponentLink5URL: https://datasheet.ciiva.com/7746/443971-7746346.pdf?src-supplier=Element14; ComponentLink5Description: https://datasheet.ciiva.com/7746/443971-7746346.pdf?src-supplier=Element14; ComponentLink6URL: https://datasheet.ciiva.com/46440/1868787-46440905.pdf?src-supplier=Element14; ComponentLink6Description: https://datasheet.ciiva.com/46440/1868787-46440905.pdf?src-supplier=Element14; Supplier Part Number 1: 311-3.30KHRCT-ND
R?#10 R?#17 = RES_1K_1%_100mW_0603: Chip Resistor Automotive Grade Thick Film 0603 1kOhm 1% Paper T/R; Manufacturer: Yageo; Voltage Rating: 50V; Temperature Coefficient: 100ppm/°C; Power Rating: 100mW; Manufacturer Part Number: AC0603FR-101KL; RoHS: Yes; Category: Chip SMD Resistors; Stock 1: 108593; Pricing 1: 1=0.10000, 10=0.02500, 100=0.01030, 1000=0.00463, 2500=0.00402, 5000=0.00332 (USD); Case Code (Imperial): 0603; Case Code (Metric): 1608; Min Operating Temperature: -55°C; Max Operating Temperature: 155°C; Packaging: Tape and Reel; Termination: SMD/SMT; Series: AC; Length: 1.6mm; Width: 0.8mm; Height: 0.45mm; RoHS Compliant: Yes; ComponentLink1URL: http://www.mouser.com/ds/2/447/yageodocoutput-1111992.pdf?src-supplier=Mouser; ComponentLink1Description: http://www.mouser.com/ds/2/447/yageodocoutput-1111992.pdf?src-supplier=Mouser; Supplier 1: Digi-Key; Supplier 2: Newark; Supplier 3: Mouser; Supplier Part Number 1: 13-AC0603FR-101KLDKR-ND; Supplier Part Number 2: 31AK9289; Supplier Part Number 3: 603-AC0603FR-101KL
R?#16 = RES_22.1K_1%_100mW_0603: SMD Chip Resistor, 22.1 kOhm, ± 1%, 100 mW, 0603 [1608 Metric], Thick Film, General Purpose; Manufacturer: Yageo; Power Rating: 100mW; Voltage Rating: 50V; Temperature Coefficient: 100ppm/°C; Supplier 1: Digikey; Manufacturer Part Number: RC0603FR-0722K1L; RoHS: Yes; Category: Chip SMD Resistors; Stock 1: 270995; Pricing 1: 1=0.1, 10=0.019, 50=0.0112, 100=0.0093, 500=0.00622, 1000=0.00532 (USD); Case Code (Imperial): 0603; Case Code (Metric): 1608; Size Code: 0603; Min Operating Temperature: -55°C; Max Operating Temperature: 155°C; Package Quantity: 5000; Packaging: Tape and Reel; Termination: SMD/SMT; Series: RC; Features: Moisture Resistant; Max Power Dissipation: 100mW; Number of Terminations: 2; Voltage Rating (DC): 50V; Length: 1.6mm; Width: 0.8mm; Height: 0.45mm; RoHS Compliant: Yes; Lead Free: 5697LeadFree; ComponentLink1URL: https://datasheet.ciiva.com/12555/rc0603-272842-12555287.pdf?src-supplier=Mouser; ComponentLink1Description: https://datasheet.ciiva.com/12555/rc0603-272842-12555287.pdf?src-supplier=Mouser; Supplier Part Number 1: 311-22.1KHRCT-ND
R?#19 = RES_47.5K_1%_100mW_0603: SMD Chip Resistor, 47.5 kOhm, ± 1%, 100 mW, 0603 [1608 Metric], Thick Film, General Purpose; Manufacturer: Yageo; Power Rating: 100mW; Voltage Rating: 50V; Temperature Coefficient: 100ppm/°C; Supplier 1: Digikey; Manufacturer Part Number: AC0603FR-0747K5L; RoHS: Yes; Category: Chip SMD Resistors; Stock 1: 18567; Pricing 1: 1=0.1, 10=0.021, 50=0.013, 100=0.0108, 500=0.00734, 1000=0.00633 (USD); Case Code (Imperial): 0603; Case Code (Metric): 1608; Min Operating Temperature: -55°C; Max Operating Temperature: 155°C; Packaging: Tape and Reel; Number of Terminations: 2; Termination: SMD/SMT; Max Power Dissipation: 100mW; Features: Moisture Resistant,Automotive AEC-Q200; Series: AC; Length: 0.063inch; Width: 0.8mm; Height: 0.022inch; Ratings: AEC-Q200; RoHS Compliant: Yes; ComponentLink1URL: http://www.mouser.com/ds/2/447/yageodocoutput-1111992.pdf?src-supplier=Mouser; ComponentLink1Description: http://www.mouser.com/ds/2/447/yageodocoutput-1111992.pdf?src-supplier=Mouser; ComponentLink2URL: https://www.yageo.com/upload/media/product/productsearch/datasheet/rchip/PYu-AC_51_RoHS_L_7.pdf?src-supplier=Digikey; ComponentLink2Description: https://www.yageo.com/upload/media/product/productsearch/datasheet/rchip/PYu-AC_51_RoHS_L_7.pdf?src-supplier=Digikey; ComponentLink3URL: http://www.yageo.com/NewPortal/yageodocoutput?fileName=/pdf/R-Chip/PYu-AC_51_RoHS_L_6.pdf&src-supplier=Digikey; ComponentLink3Description: http://www.yageo.com/NewPortal/yageodocoutput?fileName=/pdf/R-Chip/PYu-AC_51_RoHS_L_6.pdf&src-supplier=Digikey; ComponentLink4URL: http://www.yageo.com/NewPortal/yageodocoutput?fileName=/pdf/R-Chip/PYu-AC_51_RoHS_L_5.pdf&src-supplier=Digikey; ComponentLink4Description: http://www.yageo.com/NewPortal/yageodocoutput?fileName=/pdf/R-Chip/PYu-AC_51_RoHS_L_5.pdf&src-supplier=Digikey; Supplier Part Number 1: YAG5340CT-ND
S?#1 S?#2 = SWITCH_NO_SPST_0.05A: Switch Tactile N.O. SPST Round Button Gull Wing 0.05A 12VDC 200000Cycles 2.55N SMD T/R; Manufacturer: ITT C&K; Supplier 1: Digi-Key; Manufacturer Part Number: PTS526SK15SMTR2LFS; RoHS: No; Category: Uncategorized; Stock 1: 382158; Pricing 1: 1=0.12, 10=0.12, 25=0.114, 100=0.1035, 250=0.09732, 500=0.08904, 1000=0.07454 (USD); Supplier Part Number 1: CKN12221-6-ND
U?#1 U?#2 = IC_MCU_ESP32-C6-MINI-1-N4: Rf Txrx Module Bt Pcb Trace SMD; Manufacturer: Espressif Systems; Supplier 1: Digikey; Manufacturer Part Number: ESP32-C6-MINI-1-N4; RoHS: No; Stock 1: 29; Pricing 1: 1=2.5 (USD); Supplier Part Number 1: 1965-ESP32-C6-MINI-1-N4CT-ND
U?#3 = IC_REG_LDO_3.3V_1A_AP2114H-3.3TRG1: IC REG LDO 3.3V 1A SOT223; Manufacturer: Diodes; Supplier 1: Digikey; Manufacturer Part Number: AP2114H-3.3TRG1; RoHS: Yes; Category: Voltage Regulators - Linear; Stock 1: 34610; Pricing 1: 1=0.41, 10=0.332, 25=0.304, 100=0.2262, 250=0.20504, 500=0.16968, 1000=0.12726 (USD); ComponentLink1URL: https://datasheet.ciiva.com/29569/ap2114-29569881.pdf?src-supplier=Digikey; ComponentLink1Description: https://datasheet.ciiva.com/29569/ap2114-29569881.pdf?src-supplier=Digikey; ComponentLink2URL: https://datasheet.ciiva.com/29569/ap2114-29569882.pdf?src-supplier=Digikey; ComponentLink2Description: https://datasheet.ciiva.com/29569/ap2114-29569882.pdf?src-supplier=Digikey; ComponentLink3URL: https://datasheet.ciiva.com/29569/ap2114-29569883.pdf?src-supplier=Digikey; ComponentLink3Description: https://datasheet.ciiva.com/29569/ap2114-29569883.pdf?src-supplier=Digikey; Supplier Part Number 1: AP2114H-3.3TRG1DICT-ND
U?#4 = IC_BRIDGE_UART_CP2102N-A02-GQFN28R: Full Speed USB to UART Bridge USB 2.0 3.3V T/R Automotive 28-Pin QFN EP; Manufacturer: Silicon Labs; Operating Supply Current: 9.5mA; Supplier 1: Digikey; Manufacturer Part Number: CP2102N-A02-GQFN28R; RoHS: Yes; Category: USB Interface ICs; Stock 1: 29620; Pricing 1: 1=4.66, 10=4.183, 25=3.954, 100=3.4269, 250=3.2512, 500=2.91728 (USD); Case/Package: QFN; Min Operating Temperature: -40°C; Max Operating Temperature: 85°C; Interface: UART; Series: USBXpress™; Packaging: Cut Tape; ComponentLink1URL: https://www.silabs.com/documents/public/data-sheets/cp2102n-datasheet.pdf?src-supplier=Digikey; ComponentLink1Description: https://www.silabs.com/documents/public/data-sheets/cp2102n-datasheet.pdf?src-supplier=Digikey; ComponentLink2URL: https://4donline.ihs.com/images/VipMasterIC/IC/SILC/SILC-S-A0007770867/SILC-S-A0007770867-1.pdf?hkey=6D3A4C79FDBF58556ACFDE234799DDF0&src-supplier=Farnell; ComponentLink2Description: https://4donline.ihs.com/images/VipMasterIC/IC/SILC/SILC-S-A0007770867/SILC-S-A0007770867-1.pdf?hkey=6D3A4C79FDBF58556ACFDE234799DDF0&src-supplier=Farnell; Supplier Part Number 1: 336-5890-1-ND
Y? = CRYSTAL_EPSON_32.768KHZ: Crystal 0.032768MHz ±20ppm (Tol) 7pF FUND 70000Ohm 2-Pin SMD T/R; Manufacturer: Epson; ESR (Equivalent Series Resistance): 70kR; Supplier 1: Digi-Key; Manufacturer Part Number: FC-135 32.7680KA-AG5; RoHS: Yes; Category: Crystals; Stock 1: 220593; Pricing 1: 1=0.61, 10=0.505, 50=0.4544, 100=0.404, 500=0.3838, 1000=0.3232 (USD); Mount: Surface Mount; Case/Package: SMD/SMT; Min Operating Temperature: -40°C; Max Operating Temperature: 85°C; Packaging: Tape and Reel; Load Capacitance: 7pF; Frequency Tolerance: 20ppm; Series: FC-135; Length: 0.126inch; Width: 0.061inch; Height: 0.035inch; RoHS Compliant: Yes; ComponentLink1URL: https://support.epson.biz/td/api/doc_check.php?dl=brief_FC-135&amp;lang=en&src-supplier=Digi-Key; ComponentLink1Description: https://support.epson.biz/td/api/doc_check.php?dl=brief_FC-135&amp;lang=en&src-supplier=Digi-Key; ComponentLink2URL: https://support.epson.biz/td/api/doc_check.php?dl=brief_FC-135R_en.pdf&src-supplier=Digi-Key; ComponentLink2Description: https://support.epson.biz/td/api/doc_check.php?dl=brief_FC-135R_en.pdf&src-supplier=Digi-Key; ComponentLink3URL: https://datasheet.octopart.com/FC-135-32.7680KA-AG5-Epson-datasheet-140567380.pdf?src-supplier=Arrow.cn; ComponentLink3Description: https://datasheet.octopart.com/FC-135-32.7680KA-AG5-Epson-datasheet-140567380.pdf?src-supplier=Arrow.cn; Supplier Part Number 1: SER4271CT-ND

## Sheet IOT_GRN_MAIN V1.0 A - CONNECTORS.SchDoc
size A4; SheetNumber: 2; SheetTotal: 3

### Notes on the sheet
- PCB Des :
- Approv By :
- Project Title :
- Sheet Title :
- Date :
- PCB Version :
- Size :
- A4
- Page :
- PCB Revision :

## Assembly variants
Base Variant: not fitted C64 C70 C104 C108 C113 C123 C125 R8 R22 R23 R27 R28 R31 R32 R33 R34 R40 R50